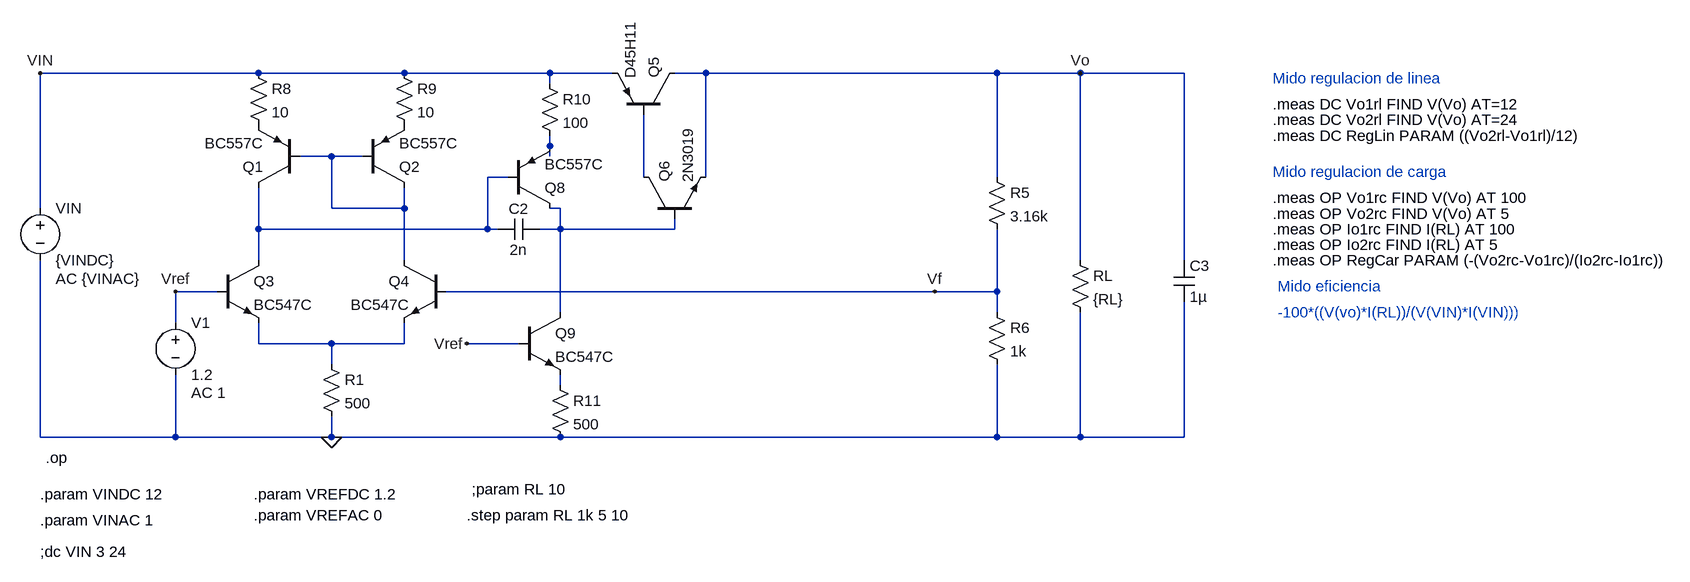
[diagram p0: schematic Regulador_Lineal_version5.asc]
Regulador_Lineal_version5.asc, the LTspice schematic file:
Version 4
SHEET 1 2316 816
WIRE 96 -32 -240 -32
WIRE 320 -32 96 -32
WIRE 544 -32 320 -32
WIRE 640 -32 544 -32
WIRE 784 -32 736 -32
WIRE 1232 -32 784 -32
WIRE 1360 -32 1232 -32
WIRE 1520 -32 1360 -32
WIRE 544 -16 544 -32
WIRE 544 80 544 64
WIRE 208 96 160 96
WIRE 256 96 208 96
WIRE 544 96 544 80
WIRE 480 128 448 128
WIRE 688 128 688 32
WIRE 784 128 784 -32
WIRE 1232 128 1232 -32
WIRE -240 176 -240 -32
WIRE 208 176 208 96
WIRE 320 176 320 144
WIRE 320 176 208 176
WIRE 560 176 544 176
WIRE 96 208 96 144
WIRE 448 208 448 128
WIRE 448 208 96 208
WIRE 464 208 448 208
WIRE 560 208 560 176
WIRE 560 208 528 208
WIRE 736 208 736 192
WIRE 736 208 560 208
WIRE 96 256 96 208
WIRE 320 256 320 176
WIRE 1360 256 1360 -32
WIRE 1520 256 1520 -32
WIRE 32 304 -32 304
WIRE 1136 304 384 304
WIRE 1232 304 1232 208
WIRE 1232 304 1136 304
WIRE 560 336 560 208
WIRE 1232 336 1232 304
WIRE -32 352 -32 304
WIRE 96 384 96 352
WIRE 208 384 96 384
WIRE 320 384 320 352
WIRE 320 384 208 384
WIRE 496 384 416 384
WIRE 208 416 208 384
WIRE 560 448 560 432
WIRE -240 528 -240 256
WIRE -32 528 -32 432
WIRE -32 528 -240 528
WIRE 208 528 208 496
WIRE 208 528 -32 528
WIRE 560 528 208 528
WIRE 1232 528 1232 416
WIRE 1232 528 560 528
WIRE 1360 528 1360 336
WIRE 1360 528 1232 528
WIRE 1520 528 1520 320
WIRE 1520 528 1360 528
FLAG 208 528 0
FLAG 1360 -32 Vo
FLAG -32 304 Vref
FLAG -240 -32 VIN
FLAG 1136 304 Vf
FLAG 416 384 Vref
DATAFLAG 1200 -32 ""
DATAFLAG 624 304 ""
SYMBOL pnp 160 144 R180
SYMATTR InstName Q1
SYMATTR Value BC557C
SYMBOL pnp 256 144 M180
SYMATTR InstName Q2
SYMATTR Value BC557C
SYMBOL npn 32 256 R0
SYMATTR InstName Q3
SYMATTR Value BC547C
SYMBOL npn 384 256 M0
SYMATTR InstName Q4
SYMATTR Value BC547C
SYMBOL res 192 400 R0
SYMATTR InstName R1
SYMATTR Value 500
SYMBOL pnp 736 32 M270
SYMATTR InstName Q5
SYMATTR Value D45H11
SYMBOL npn 688 192 R270
SYMATTR InstName Q6
SYMATTR Value 2N3019
SYMBOL res 1216 112 R0
SYMATTR InstName R5
SYMATTR Value 3.16k
SYMBOL res 1216 320 R0
SYMATTR InstName R6
SYMATTR Value 1k
SYMBOL res 1344 240 R0
SYMATTR InstName RL
SYMATTR Value {RL}
SYMBOL voltage -32 336 R0
WINDOW 123 24 124 Left 2
WINDOW 39 0 0 Left 0
SYMATTR Value2 AC 1
SYMATTR InstName V1
SYMATTR Value 1.2
SYMBOL voltage -240 160 R0
WINDOW 123 24 124 Left 2
WINDOW 39 0 0 Left 0
SYMATTR Value2 AC {VINAC}
SYMATTR InstName VIN
SYMATTR Value {VINDC}
SYMBOL res 80 -48 R0
SYMATTR InstName R8
SYMATTR Value 10
SYMBOL res 304 -48 R0
SYMATTR InstName R9
SYMATTR Value 10
SYMBOL pnp 480 176 M180
SYMATTR InstName Q8
SYMATTR Value BC557C
SYMBOL res 528 -32 R0
SYMATTR InstName R10
SYMATTR Value 100
SYMBOL cap 528 192 R90
WINDOW 0 0 32 VBottom 2
WINDOW 3 32 32 VTop 2
SYMATTR InstName C2
SYMATTR Value 2n
SYMATTR SpiceLine Rser=1k
SYMBOL npn 496 336 R0
SYMATTR InstName Q9
SYMATTR Value BC547C
SYMBOL res 544 432 R0
SYMATTR InstName R11
SYMATTR Value 500
SYMBOL cap 1504 256 R0
SYMATTR InstName C3
SYMATTR Value 1µ
TEXT -232 560 Left 2 !.op
TEXT -240 704 Left 2 !;dc VIN 3 24
TEXT 1656 -24 Left 2 ;Mido regulacion de linea
TEXT 1656 16 Left 2 !.meas DC Vo1rl FIND V(Vo) AT=12
TEXT 1656 40 Left 2 !.meas DC Vo2rl FIND V(Vo) AT=24
TEXT 1656 64 Left 2 !.meas DC RegLin PARAM ((Vo2rl-Vo1rl)/12)
TEXT 1656 120 Left 2 ;Mido regulacion de carga
TEXT 1656 160 Left 2 !.meas OP Vo1rc FIND V(Vo) AT 100
TEXT 1656 184 Left 2 !.meas OP Vo2rc FIND V(Vo) AT 5
TEXT 1656 208 Left 2 !.meas OP Io1rc FIND I(RL) AT 100
TEXT 1656 232 Left 2 !.meas OP Io2rc FIND I(RL) AT 5
TEXT 1664 296 Left 2 ;Mido eficiencia
TEXT 1664 336 Left 2 ;-100*((V(vo)*I(RL))/(V(VIN)*I(VIN)))
TEXT -240 616 Left 2 !.param VINDC 12
TEXT -240 656 Left 2 !.param VINAC 1
TEXT 88 616 Left 2 !.param VREFDC 1.2
TEXT 88 648 Left 2 !.param VREFAC 0
TEXT 424 608 Left 2 !;param RL 10
TEXT 416 648 Left 2 !.step param RL 1k 5 10
TEXT 1656 256 Left 2 !.meas OP RegCar PARAM (-(Vo2rc-Vo1rc)/(Io2rc-Io1rc))

The netlist it stands for:
* Regulador_Lineal_version5.asc
Q1 N003 N002 P001 0 BC557C
Q2 N002 N002 P002 0 BC557C
Q3 N003 Vref N006 0 BC547C
Q4 N002 Vf N006 0 BC547C
R1 N006 0 500
Q5 Vo N004 VIN 0 D45H11
Q6 N004 N005 Vo 0 2N3019
R5 Vo Vf 3.16k
R6 Vf 0 1k
RL Vo 0 {RL}
V1 Vref 0 1.2 AC 1
VIN VIN 0 {VINDC} AC {VINAC}
R8 VIN P001 10
R9 VIN P002 10
Q8 N005 N003 N001 0 BC557C
R10 VIN N001 100
C2 N005 N003 2n Rser=1k
Q9 N005 Vref N007 0 BC547C
R11 N007 0 500
C3 Vo 0 1µ
.model NPN NPN
.model PNP PNP
.lib standard.bjt
.op
;dc VIN 3 24
* Mido regulacion de linea
.meas DC Vo1rl FIND V(Vo) AT=12
.meas DC Vo2rl FIND V(Vo) AT=24
.meas DC RegLin PARAM ((Vo2rl-Vo1rl)/12)
* Mido regulacion de carga
.meas OP Vo1rc FIND V(Vo) AT 100
.meas OP Vo2rc FIND V(Vo) AT 5
.meas OP Io1rc FIND I(RL) AT 100
.meas OP Io2rc FIND I(RL) AT 5
* Mido eficiencia
* -100*((V(vo)*I(RL))/(V(VIN)*I(VIN)))
.param VINDC 12
.param VINAC 1
.param VREFDC 1.2
.param VREFAC 0
;param RL 10
.step param RL 1k 5 10
.meas OP RegCar PARAM (-(Vo2rc-Vo1rc)/(Io2rc-Io1rc))
.backanno
.end